# EAGLE design dp2usbc (EAGLE 6.6.0)
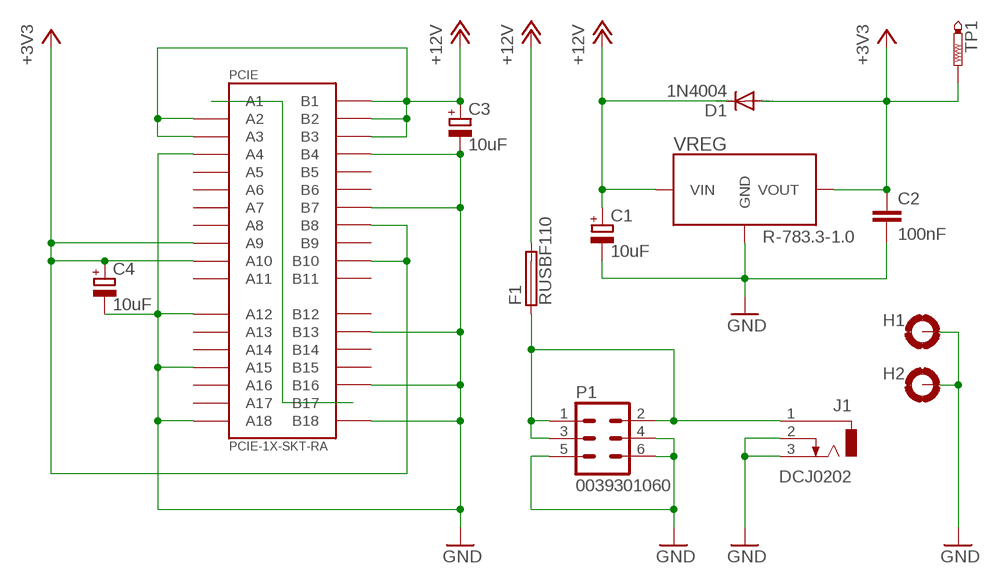
[diagram p0: schematic, sheet 1]

## Parts
C1  10uF  CPOL-EUE1.8-4  [E1,8-4]
C2  100nF  C-EU025-024X044  [C025-024X044]
C3  10uF  CPOL-EUE1.8-4  [E1,8-4]
C4  10uF  CPOL-EUE1.8-4  [E1,8-4]
D1  1N4004  [DO41-10]
F1  RUSBF110  LITTLEFUSE  [LITTLEFUSE]
H1  MOUNT-PAD-ROUND3.2  [3,2-PAD]
H2  MOUNT-PAD-ROUND3.2  [3,2-PAD]
J1  DCJ0202  [DCJ0202]
P1  0039301060  [0039301060]
PCIE  PCIE-1X-SKT-RA  [PCIE-1X-SKT-RA]
TP1  PTR1B1,27  [B1,27]
VREG  R-783.3-1.0  VREG-RECOM-78  [VREG-RECOM-78*]

## Nets
+3V3: C2.1 C4.+ D1.A PCIE.A9 PCIE.A10 PCIE.B8 PCIE.B10 TP1.TP VREG.VOUT
+12V [pwr]: C1.+ C3.+ D1.C F1.2 PCIE.A2 PCIE.A3 PCIE.B1 PCIE.B2 PCIE.B3 VREG.VIN
GND [pwr]: C1.- C2.2 C3.- C4.- H1.B3,2(MOUNT) H2.B3,2(MOUNT) J1.2 J1.3 P1.4 P1.5 P1.6 PCIE.A4 PCIE.A12 PCIE.A15 PCIE.A18 PCIE.B4 PCIE.B7 PCIE.B13 PCIE.B16 PCIE.B18 VREG.GND
N$1: PCIE.A1 PCIE.B17
N$3 [pwr]: F1.1 J1.1 P1.1 P1.2 P1.3
Unconnected: PCIE.A5 PCIE.A6 PCIE.A7 PCIE.A8 PCIE.A11 PCIE.A13 PCIE.A14 PCIE.A16 PCIE.A17 PCIE.B5 PCIE.B6 PCIE.B9 PCIE.B12 PCIE.B14 PCIE.B15

## Power pins joined to a net without a drawn wire
B11: PCIE.B11

## Library data of the parts
C1 C3 C4 = rcl:CPOL-EU: POLARIZED CAPACITOR, European symbol
C2 = rcl:C-EU: CAPACITOR, European symbol
D1 = diode:1N4004: DIODE general purpose rectifier, 1 A
F1 = cw-littlefuse:LITTLEFUSE: LITTLEFUSE Littelfuse PolySwitch; MF: Littlefuse; MPN: RUSBF110
H1 H2 = holes:MOUNT-PAD-ROUND: MOUNTING PAD, round
J1 = cw-con-jack:DCJ0202: DC POWER JACK Source: DCJ0202.pdf; OC_FARNELL: unknown; OC_NEWARK: unknown
P1 = con-molex-mini-fit:0039301060: HEADER
PCIE = pcie1x:PCIE-1X-*: PCI-E 1x connector; MF: ERNI Electronics; MPN: 009000; OC_MOUSER: 305-9000
TP1 = testpad:PTR1: TEST PIN
VREG = vreg-recom-r-7850-1:VREG-RECOM-78*: Recom DC/DC Convertor

## Net classes
1 pwr: width 0.254 mm

## Board
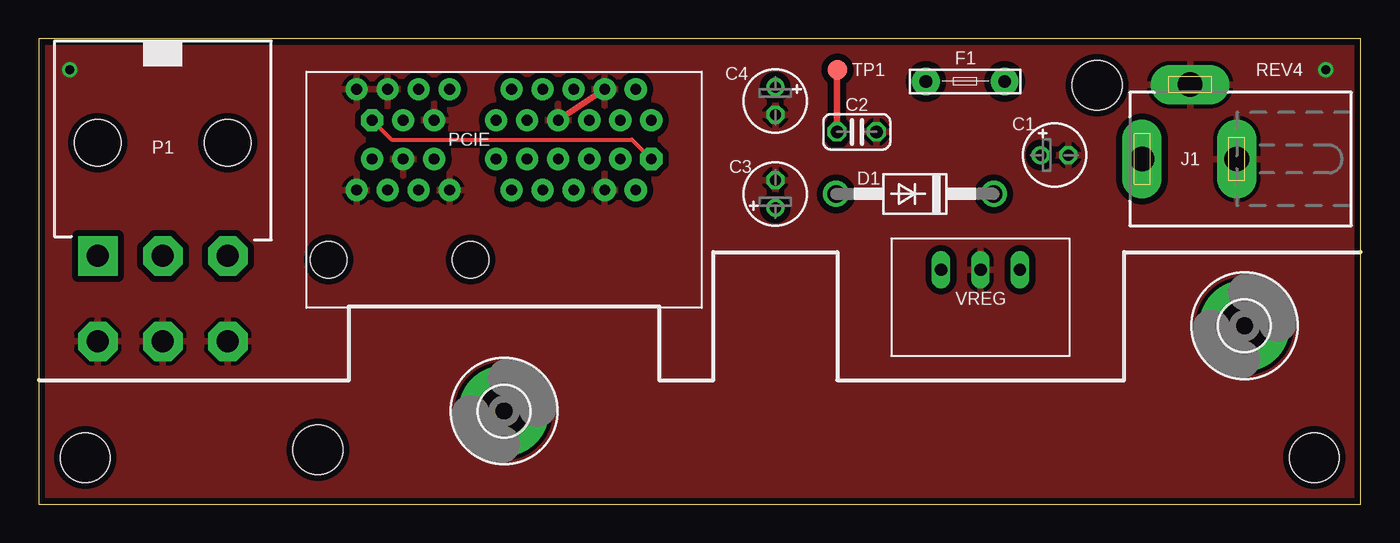
[diagram p1: board, top side]
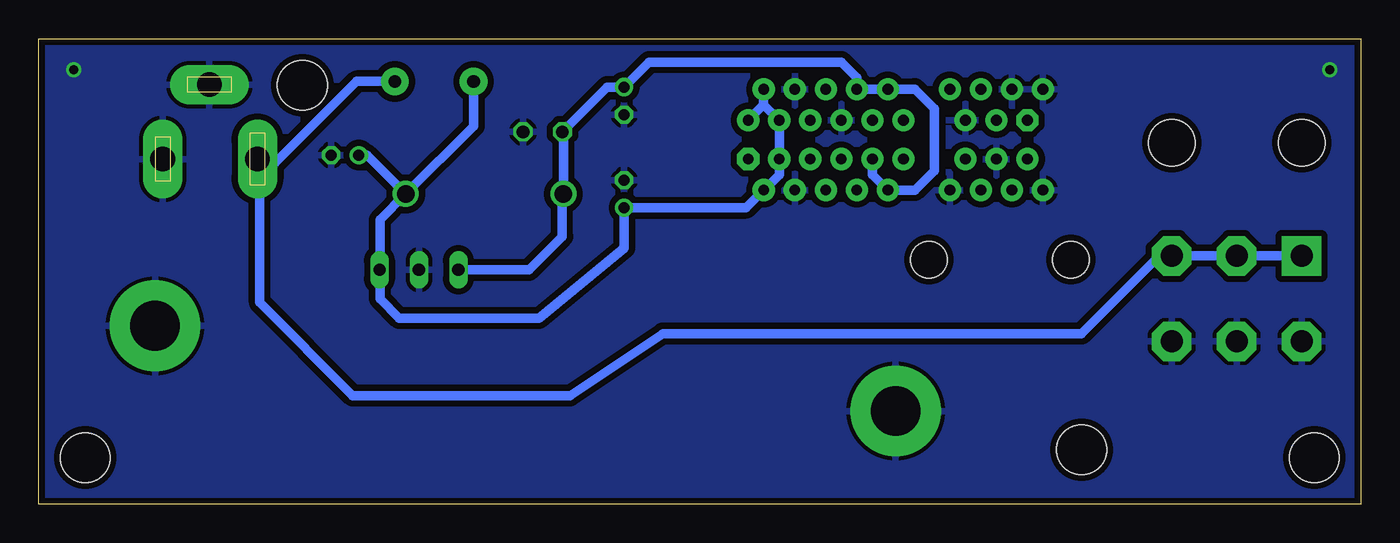
[diagram p2: board, bottom side, seen from below]

Size 85.25 x 30 mm. Coordinates in mm from the lower left corner, seen from the top.
Outline: 0,0 85.25,0 85.25,30 0,30 0,0
Copper layers (1*16): Top 0.0356mm / dielectric 1.5011mm / Bottom 0.0356mm
Design rules "LaenPCBOrder": minimum track width 6mil, minimum drill 13mil, track to track 6mil, track to pad 6mil, pad to pad 6mil, via to via 6mil, smd to smd 6mil, copper to edge 15mil, drill to drill 6mil, minimum pad ring 7mil, minimum via ring 7mil, stop-mask expansion 4mil, vias tented up to drill 0mil, thermal gap 10mil
Holes 3.2 mm at 18,3.5 3,3 82.25,3 68.25,27

### Footprints (pad centres in the part's own frame; a part is rotated, then mirrored left to right if it is on the bottom)
E1,8-4 = drill 0.711 pad 1.168: + -0.889,0 | drill 0.711 pad 1.168 octagon: - 0.889,0
C025-024X044 = drill 0.813 octagon: 1 -1.27,0; 2 1.27,0
DO41-10 = drill 1.118: A 5.08,0; C -5.08,0
LITTLEFUSE = drill 0.813 pad 1.778: 1 -2.54,0; 2 2.54,0
3,2-PAD = drill 3.2 pad 5.842: B3,2 0,0
DCJ0202 = drill 1.6 pad 2.54 long: 1 0,3.1; 2 4.8,0; 3 0,-3
0039301060 = drill 1.422 pad 2.54 square: 1 4.191,0 | drill 1.422 pad 2.54 octagon: 2 0,0; 3 -4.191,0; 4 4.191,5.512; 5 0,5.512; 6 -4.191,5.512 | hole 3: -4.191,-7.3; 4.191,-7.3
PCIE-1X-SKT-RA = drill 0.7 pad 1.422 octagon: A1 8,-1.25; B17 -10,1.25 | drill 0.7 pad 1.422: A2 7,-3.25; A3 6,-1.25; A4 5,-3.25; A5 4,-1.25; A6 3,-3.25; A7 2,-1.25; A8 1,-3.25; A9 0,-1.25; A10 -1,-3.25; A11 -2,-1.25; A12 -5,-3.25; A13 -6,-1.25; A14 -7,-3.25; A15 -8,-1.25; A16 -9,-3.25; A17 -10,-1.25; A18 -11,-3.25; B1 8,1.25; B2 7,3.25; B3 6,1.25; B4 5,3.25; B5 4,1.25; B6 3,3.25; B7 2,1.25; B8 1,3.25; B9 0,1.25; B10 -1,3.25; B11 -2,1.25; B12 -5,3.25; B13 -6,1.25; B14 -7,3.25; B15 -8,1.25; B16 -9,3.25; B18 -11,3.25 | hole 2.35: -12.8,-7.73; -3.65,-7.73
B1,27 = smd 1.27 x 1.27: TP 0,0
VREG-RECOM-78* = drill 0.8 long: GND 0.02,-1.61; VIN -2.52,-1.61; VOUT 2.56,-1.61

### Placement (x,y rotation side)
C1  65.5,22.5 0 top
C2  52.75,24 0 top
C3  47.5,20 90 top
C4  47.5,26 270 top
D1  56.5,20 180 top
F1  59.75,27.25 180 top
H1  77.75,11.5 0 top
H2  30,6 0 top
J1  74.25,22.25 90 top
P1  8,16 180 top
PCIE  31.5,23.5 0 top
TP1  51.5,28 0 top
VREG  60.75,13.5 180 top

### Tracks (layer width: path | path; a pad name or v marks a point on that pad's centre or on a via)
+3V3
  Top 0.406: C2.1 51.48,27.98 TP1.TP
  Bottom 0.406: 51.5,19.92 D1.A | 51.42,23.94 C2.1
  Bottom 0.61: PCIE.A9 31.5,21.25 PCIE.A10 28.75,20.25 27.5,21.5 27.5,25.5 28.75,26.75 PCIE.B10 PCIE.B8 32.5,27.5 33.5,28.5 45.89,28.5 C4.+ 48.59,26.89 C2.1 | VREG.VOUT 53.64,15.11 51.5,17.25 51.5,19.92 | D1.A 51.42,23.94
+12V
  Bottom 0.61: PCIE.B2 38.5,25.75 | 38.5,25.75 PCIE.B3 PCIE.A3 37.5,21.25 PCIE.A2 39.64,19.11 C3.+ 47.5,16.5 53,12 62,12 63.25,13.25 63.25,15.09 VREG.VIN 63.25,15.13 63.25,18.33 D1.C | 38.5,25.75 PCIE.B1 | D1.C 62,20 | C1.+ 64.08,22.5 D1.C | F1.2 57.21,24.37 D1.C
GND  (via drill 0.6)
  Top 0.406: PCIE.B7 PCIE.B4
  other vias: 2,28 83,28
  pour Top (isolate 0.406): 0.5,0.5 0.5,29.5 84.75,29.5 84.75,0.5
  pour Bottom (isolate 0.406): 0.5,0.5 0.5,29.5 84.75,29.5 84.75,0.5
N$1
  Top 0.254: PCIE.B17 22.75,23.5 38.25,23.5 PCIE.A1
N$3
  Bottom 0.61: P1.1 P1.2 P1.3 13,16 18,11 45,11 51,7 65,7 71,13 71,21.1 70.9,22 | F1.1 64.75,27.25 70,22 70.9,22 | 70.9,22 J1.1

### Text on the board
tNames: REV4